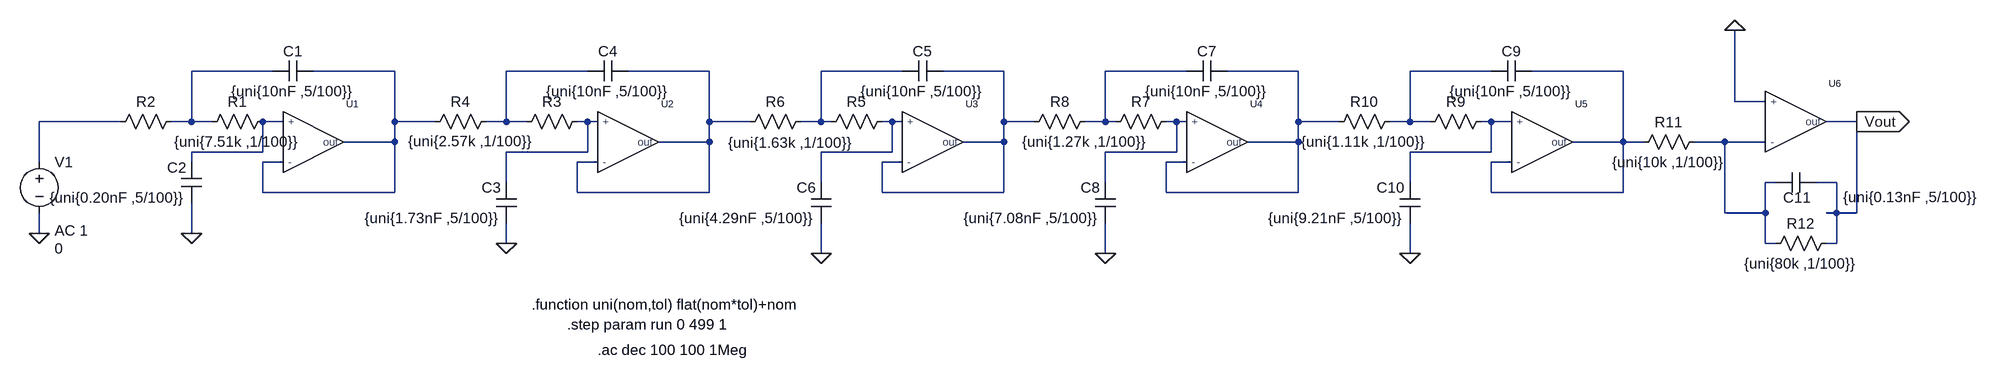
[diagram p0: schematic LPF.asc]
LPF.asc, the LTspice schematic file:
Version 4
SHEET 1 1592 680
WIRE -1584 -96 -1712 -96
WIRE -1392 -96 -1520 -96
WIRE -1088 -96 -1216 -96
WIRE -896 -96 -1024 -96
WIRE -592 -96 -720 -96
WIRE -432 -96 -528 -96
WIRE -144 -96 -272 -96
WIRE 32 -96 -80 -96
WIRE 336 -96 208 -96
WIRE 544 -96 400 -96
WIRE 720 -48 720 -160
WIRE 768 -48 720 -48
WIRE -1824 -16 -1952 -16
WIRE -1712 -16 -1712 -96
WIRE -1712 -16 -1744 -16
WIRE -1680 -16 -1712 -16
WIRE -1568 -16 -1600 -16
WIRE -1392 -16 -1392 -96
WIRE -1328 -16 -1392 -16
WIRE -1216 -16 -1216 -96
WIRE -1216 -16 -1248 -16
WIRE -1184 -16 -1216 -16
WIRE -1088 -16 -1104 -16
WIRE -1072 -16 -1088 -16
WIRE -896 -16 -896 -96
WIRE -832 -16 -896 -16
WIRE -720 -16 -720 -96
WIRE -720 -16 -752 -16
WIRE -704 -16 -720 -16
WIRE -608 -16 -624 -16
WIRE -592 -16 -608 -16
WIRE -432 -16 -432 -96
WIRE -384 -16 -432 -16
WIRE -272 -16 -272 -96
WIRE -272 -16 -304 -16
WIRE -256 -16 -272 -16
WIRE -160 -16 -176 -16
WIRE -144 -16 -160 -16
WIRE 32 -16 32 -96
WIRE 96 -16 32 -16
WIRE 208 -16 208 -96
WIRE 208 -16 176 -16
WIRE 240 -16 208 -16
WIRE 336 -16 320 -16
WIRE 368 -16 336 -16
WIRE 912 -16 864 -16
WIRE -1392 16 -1392 -16
WIRE -1392 16 -1472 16
WIRE -896 16 -896 -16
WIRE -896 16 -976 16
WIRE -432 16 -432 -16
WIRE -432 16 -496 16
WIRE 32 16 32 -16
WIRE 32 16 -48 16
WIRE 544 16 544 -96
WIRE 544 16 464 16
WIRE 576 16 544 16
WIRE 704 16 656 16
WIRE 768 16 704 16
WIRE -1600 32 -1600 -16
WIRE -1600 32 -1712 32
WIRE -1088 32 -1088 -16
WIRE -1088 32 -1216 32
WIRE -608 32 -608 -16
WIRE -608 32 -720 32
WIRE -160 32 -160 -16
WIRE -160 32 -272 32
WIRE 336 32 336 -16
WIRE 336 32 208 32
WIRE -1952 48 -1952 -16
WIRE -1712 48 -1712 32
WIRE -1568 48 -1600 48
WIRE -1072 48 -1104 48
WIRE -592 48 -624 48
WIRE -144 48 -176 48
WIRE 368 48 336 48
WIRE -1216 80 -1216 32
WIRE -720 80 -720 32
WIRE -272 80 -272 32
WIRE 208 80 208 32
WIRE 784 80 768 80
WIRE 880 80 848 80
WIRE -1600 96 -1600 48
WIRE -1392 96 -1392 16
WIRE -1392 96 -1600 96
WIRE -1104 96 -1104 48
WIRE -896 96 -896 16
WIRE -896 96 -1104 96
WIRE -624 96 -624 48
WIRE -432 96 -432 16
WIRE -432 96 -624 96
WIRE -176 96 -176 48
WIRE 32 96 32 16
WIRE 32 96 -176 96
WIRE 336 96 336 48
WIRE 544 96 544 16
WIRE 544 96 336 96
WIRE 704 128 704 16
WIRE 768 128 768 80
WIRE 768 128 704 128
WIRE 880 128 880 80
WIRE 880 128 864 128
WIRE 912 128 912 -16
WIRE 912 128 880 128
WIRE -1952 160 -1952 128
WIRE -1712 160 -1712 112
WIRE -1216 176 -1216 144
WIRE 768 176 768 128
WIRE 784 176 768 176
WIRE 880 176 880 128
WIRE 880 176 864 176
WIRE -720 192 -720 144
WIRE -272 192 -272 144
WIRE 208 192 208 144
FLAG -1712 160 0
FLAG -1216 176 0
FLAG -720 192 0
FLAG -272 192 0
FLAG 208 192 0
FLAG -1952 160 0
FLAG 720 -160 0
FLAG 912 -16 Vout
IOPIN 912 -16 Out
SYMBOL res -1696 0 R270
WINDOW 0 32 56 VTop 2
WINDOW 3 0 56 VBottom 2
SYMATTR InstName R1
SYMATTR Value {uni{7.51k ,1/100}}
SYMBOL res -1840 0 R270
WINDOW 0 32 56 VTop 2
WINDOW 3 0 56 Invisible 2
SYMATTR InstName R2
SYMATTR Value {uni{7.51k ,1/100}}
SYMBOL res -1200 0 R270
WINDOW 0 32 56 VTop 2
WINDOW 3 1 -71 VBottom 2
SYMATTR InstName R3
SYMATTR Value {uni{2.57k ,1/100}}
SYMBOL res -1344 0 R270
WINDOW 0 32 56 VTop 2
WINDOW 3 0 56 Invisible 2
SYMATTR InstName R4
SYMATTR Value {uni{2.57k ,1/100}}
SYMBOL res -720 0 R270
WINDOW 0 32 56 VTop 2
WINDOW 3 -1 -20 Invisible 2
SYMATTR InstName R5
SYMATTR Value {uni{1.63k ,1/100}}
SYMBOL res -848 0 R270
WINDOW 0 32 56 VTop 2
WINDOW 3 -1 81 VBottom 2
SYMATTR InstName R6
SYMATTR Value {uni{1.63k ,1/100}}
SYMBOL res -272 0 R270
WINDOW 0 32 56 VTop 2
WINDOW 3 0 -32 VBottom 2
SYMATTR InstName R7
SYMATTR Value {uni{1.27k ,1/100}}
SYMBOL res -400 0 R270
WINDOW 0 32 56 VTop 2
WINDOW 3 0 56 Invisible 2
SYMATTR InstName R8
SYMATTR Value {uni{1.27k ,1/100}}
SYMBOL res 224 0 R270
WINDOW 0 32 56 VTop 2
WINDOW 3 0 56 Invisible 2
SYMATTR InstName R9
SYMATTR Value {uni{1.11k ,1/100}}
SYMBOL res 80 0 R270
WINDOW 0 32 56 VTop 2
WINDOW 3 0 56 VBottom 2
SYMATTR InstName R10
SYMATTR Value {uni{1.11k ,1/100}}
SYMBOL cap -1584 -80 R270
WINDOW 0 32 32 VTop 2
WINDOW 3 0 32 VBottom 2
SYMATTR InstName C1
SYMATTR Value {uni{10nF ,5/100}}
SYMBOL cap -1696 112 R180
WINDOW 0 24 56 Left 2
WINDOW 3 24 8 Left 2
SYMATTR InstName C2
SYMATTR Value {uni{0.20nF ,5/100}}
SYMBOL cap -1200 144 R180
WINDOW 0 24 56 Left 2
WINDOW 3 24 8 Left 2
SYMATTR InstName C3
SYMATTR Value {uni{1.73nF ,5/100}}
SYMBOL cap -1088 -80 R270
WINDOW 0 32 32 VTop 2
WINDOW 3 0 32 VBottom 2
SYMATTR InstName C4
SYMATTR Value {uni{10nF ,5/100}}
SYMBOL cap -592 -80 R270
WINDOW 0 32 32 VTop 2
WINDOW 3 0 32 VBottom 2
SYMATTR InstName C5
SYMATTR Value {uni{10nF ,5/100}}
SYMBOL cap -704 144 R180
WINDOW 0 24 56 Left 2
WINDOW 3 24 8 Left 2
SYMATTR InstName C6
SYMATTR Value {uni{4.29nF ,5/100}}
SYMBOL cap -144 -80 R270
WINDOW 0 32 32 VTop 2
WINDOW 3 0 32 VBottom 2
SYMATTR InstName C7
SYMATTR Value {uni{10nF ,5/100}}
SYMBOL cap -256 144 R180
WINDOW 0 24 56 Left 2
WINDOW 3 24 8 Left 2
SYMATTR InstName C8
SYMATTR Value {uni{7.08nF ,5/100}}
SYMBOL cap 336 -80 R270
WINDOW 0 32 32 VTop 2
WINDOW 3 0 32 VBottom 2
SYMATTR InstName C9
SYMATTR Value {uni{10nF ,5/100}}
SYMBOL cap 224 144 R180
WINDOW 0 24 56 Left 2
WINDOW 3 24 8 Left 2
SYMATTR InstName C10
SYMATTR Value {uni{9.21nF ,5/100}}
SYMBOL voltage -1952 32 R0
WINDOW 123 24 124 Left 2
WINDOW 39 0 0 Left 2
WINDOW 3 24 152 Left 2
SYMATTR Value2 AC 1
SYMATTR Value 0
SYMATTR InstName V1
SYMBOL AutoGenerated\\onepole -1520 16 R0
WINDOW 3 6 74 Invisible 2
SYMATTR InstName U1
SYMBOL AutoGenerated\\onepole -1024 16 R0
WINDOW 3 6 74 Invisible 2
SYMATTR InstName U2
SYMBOL AutoGenerated\\onepole -544 16 R0
WINDOW 3 6 74 Invisible 2
SYMATTR InstName U3
SYMBOL AutoGenerated\\onepole -96 16 R0
WINDOW 3 6 74 Invisible 2
SYMATTR InstName U4
SYMBOL AutoGenerated\\onepole 416 16 R0
WINDOW 3 6 74 Invisible 2
SYMATTR InstName U5
SYMBOL res 672 0 R90
WINDOW 0 0 56 VBottom 2
WINDOW 3 32 56 VTop 2
SYMATTR InstName R11
SYMATTR Value {uni{10k ,1/100}}
SYMBOL cap 784 96 R270
WINDOW 0 -23 34 VTop 2
WINDOW 3 9 214 VBottom 2
SYMATTR InstName C11
SYMATTR Value {uni{0.13nF ,5/100}}
SYMBOL res 880 160 R90
WINDOW 0 0 56 VBottom 2
WINDOW 3 32 56 VTop 2
SYMATTR InstName R12
SYMATTR Value {uni{80k ,1/100}}
SYMBOL AutoGenerated\\onepole 816 -16 R0
WINDOW 3 6 74 Invisible 2
SYMATTR InstName U6
TEXT -1072 344 Left 2 !.ac dec 100 100 1Meg
TEXT -1176 272 Left 2 !.function uni(nom,tol) flat(nom*tol)+nom
TEXT -1120 304 Left 2 !.step param run 0 499 1

The netlist it stands for:
* LPF.asc
R1 N001 N012 {uni{7.51k ,1/100}}
R2 N011 N001 {uni{7.51k ,1/100}}
R3 N003 N013 {uni{2.57k ,1/100}}
R4 N002 N003 {uni{2.57k ,1/100}}
R5 N005 N014 {uni{1.63k ,1/100}}
R6 N004 N005 {uni{1.63k ,1/100}}
R7 N007 N015 {uni{1.27k ,1/100}}
R8 N006 N007 {uni{1.27k ,1/100}}
R9 N009 N016 {uni{1.11k ,1/100}}
R10 N008 N009 {uni{1.11k ,1/100}}
C1 N001 N002 {uni{10nF ,5/100}}
C2 0 N012 {uni{0.20nF ,5/100}}
C3 0 N013 {uni{1.73nF ,5/100}}
C4 N003 N004 {uni{10nF ,5/100}}
C5 N005 N006 {uni{10nF ,5/100}}
C6 0 N014 {uni{4.29nF ,5/100}}
C7 N007 N008 {uni{10nF ,5/100}}
C8 0 N015 {uni{7.08nF ,5/100}}
C9 N009 N010 {uni{10nF ,5/100}}
C10 0 N016 {uni{9.21nF ,5/100}}
V1 N011 0 0 AC 1
XU1 N012 N002 N002 onepole  ; pins + - out
XU2 N013 N004 N004 onepole  ; pins + - out
XU3 N014 N006 N006 onepole  ; pins + - out
XU4 N015 N008 N008 onepole  ; pins + - out
XU5 N016 N010 N010 onepole  ; pins + - out
R11 N017 N010 {uni{10k ,1/100}}
C11 N017 Vout {uni{0.13nF ,5/100}}
R12 Vout N017 {uni{80k ,1/100}}
XU6 0 N017 Vout onepole  ; pins + - out
.ac dec 100 100 1Meg
.function uni(nom,tol) flat(nom*tol)+nom
.step param run 0 499 1
.lib OPAMP.sub
.backanno
.end